# Altium project CABINET_IOT-V1.PrjPcb (part 2 of 2)
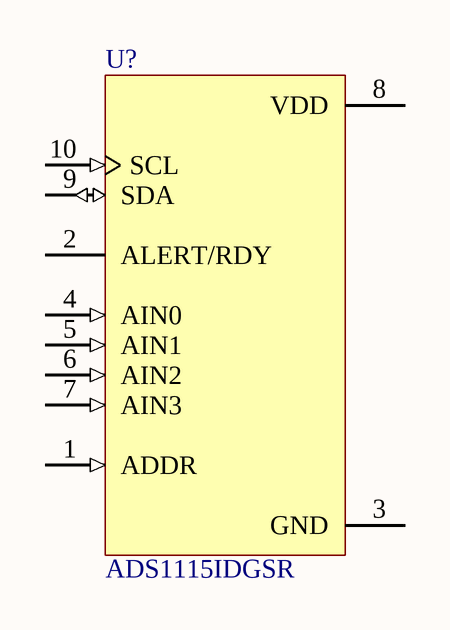
[diagram p6: 400_Sensors.SchDoc]

## Nets that join several sheets
+5V: 100_Power Supply (8 pins), 300_Control (D?#4.K D?#5.K K?#1.4 K?#2.4)
+12V: 000_MCU - ESP32 (11 pins), 100_Power Supply (25 pins), 200_Ethernet (60 pins), 300_Control (8 pins)
AC_L: 100_Power Supply (LC?.4 U?#1.1), 300_Control (K?#1.5 K?#2.5 R?#71.1 R?#76.1)
AC_N: 100_Power Supply (LC?.3 U?#1.2), 300_Control (X?#3.2 X?#5.1 X?#6.2 X?#7.1)
MDIO_LAN: 000_MCU - ESP32 (8 pins), 100_Power Supply (5 pins), 200_Ethernet (41 pins)
EMAC_REF_CLK: 000_MCU - ESP32 (MOD?.25 R?#8.1 S?.1 S?.2), 200_Ethernet (R?#44.2)
FAN_CTRL1: 000_MCU - ESP32 (MOD?.26), 300_Control (R?#74.2)
FAN_CTRL2: 000_MCU - ESP32 (MOD?.28), 300_Control (R?#77.2)
FAN_CTRL3: 000_MCU - ESP32 (MOD?.14), 300_Control (R?#72.2)
IO16_OSC_EN: 000_MCU - ESP32 (MOD?.27 R?#1.1 R?#2.2), 200_Ethernet (Y?.1)
NetR?#16_2: 000_MCU - ESP32 (R?#16.2), 200_Ethernet (R?#41.2)
NetR?#17_2: 000_MCU - ESP32 (R?#17.2), 200_Ethernet (R?#42.2)